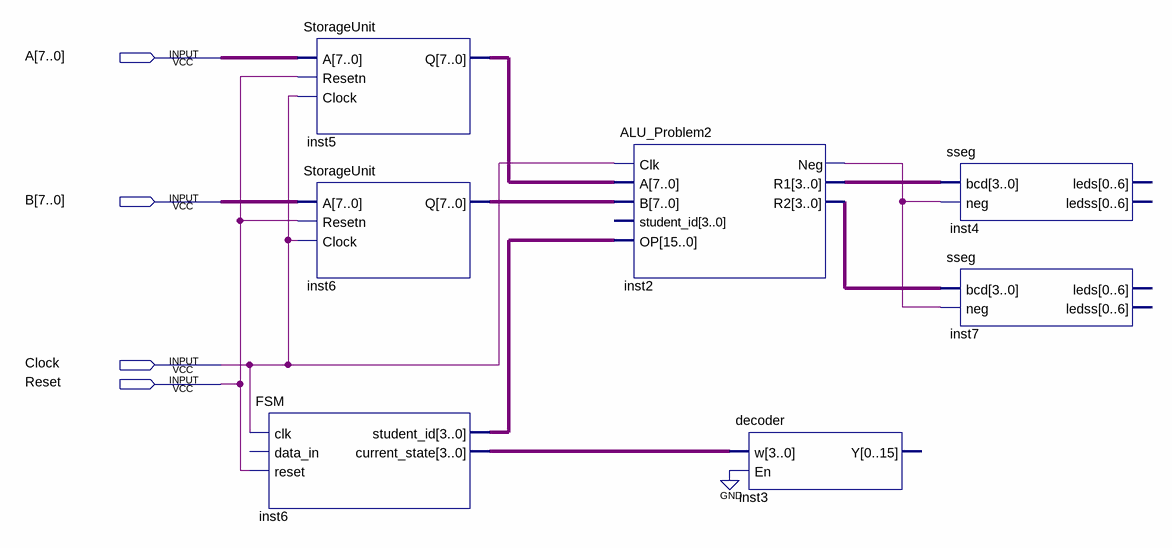
[diagram p0: schematic sheet]
// Quartus schematic Lab6.bdf as structural Verilog: 7 symbols, 4 pins
module Lab6 (
  input  [7:0] A,
  input  [7:0] B,
  input  Clock,
  input  Reset
);

  wire inst2_neg;
  wire [3:0] inst2_r1, inst2_r2, inst6_current_state;
  wire [7:0] inst5_q, inst6_q;
  wire [15:0] inst6_student_id;

  FSM inst6 (
    .clk(Clock), .reset(Reset), .student_id(inst6_student_id), .current_state(inst6_current_state));  // open: data_in
  StorageUnit inst5 (.A(A), .Resetn(Reset), .Clock(Clock), .Q(inst5_q));
  StorageUnit inst6_dup2 (.A(B), .Resetn(Reset), .Clock(Clock), .Q(inst6_q));
  ALU_Problem2 inst2 (
    .Clk(Clock), .A(inst5_q), .B(inst6_q), .OP(inst6_student_id), .Neg(inst2_neg), .R1(inst2_r1),
    .R2(inst2_r2));  // open: student_id
  decoder inst3 (.w(inst6_current_state), .En(1'b0));  // open: Y
  sseg inst4 (.bcd(inst2_r1), .neg(inst2_neg));  // open: leds, ledss
  sseg inst7 (.bcd(inst2_r2), .neg(inst2_neg));  // open: leds, ledss
endmodule
